# Altium schematic sheet RUH30J51M1_RUH30J51M.schdoc.schdoc
size 127 x 101 mm
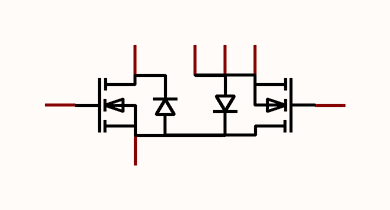
[diagram p0: RUH30J51M1_RUH30J51M.schdoc.schdoc]

## Parts
U?  RUH30J51M  [DFN-8_L6.0-W5.0-P1.27_AON6938]  (value not drawn)

## Nets

Not connected (* = marked no-connect by the designer): U? 1(G1) 2(D1) 3(S2) 4(S2) 5(S2) 6(G2) 7(S1/D2)

## Library data of the parts
U? = RUH30J51M: Manufacturer: Ruichips(锐骏半导体); Add into BOM: yes; Symbol: RUH30J51M; Device: RUH30J51M; LCSC Part Name: RUH30J51M; Supplier Part: C3019595; Manufacturer Part: RUH30J51M; Supplier Footprint: DFN-8(5x6); JLCPCB Part Class: Extended Part; Datasheet: https://atta.szlcsc.com/upload/public/pdf/source/20220614/0174D7ED654B176846E53ECDED748663.pdf; Supplier: LCSC; Convert to PCB: yes